# EAGLE design UKHASnet-avr-sensor (EAGLE 6.4)
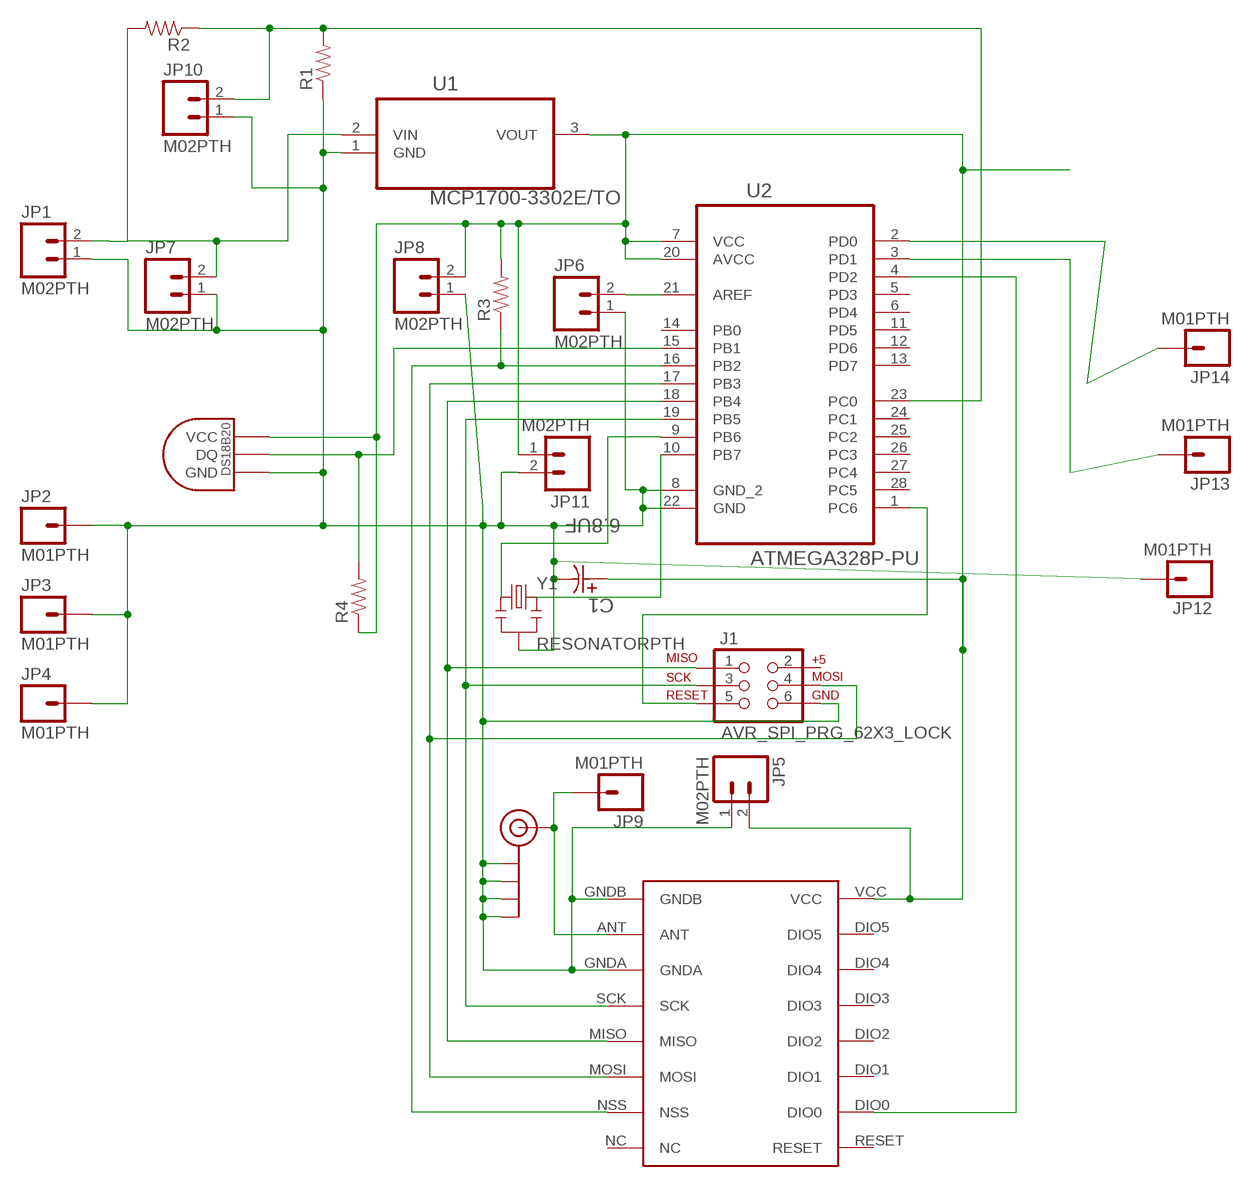
[diagram p0: schematic, sheet 1]

## Parts
C1  6.8UF  EEUFC1J6R8-P1.5  [CAPPR150-400X1200]
J1  AVR_SPI_PRG_62X3_LOCK  [2X3_LOCK]
J$1  SMA_EDGE  [SMA-EDGE]
JP1  M02PTH  [1X02]
JP2  M01PTH  [1X01]
JP3  M01PTH  [1X01]
JP4  M01PTH  [1X01]
JP5  M02PTH  [1X02]
JP6  M02PTH  [1X02]
JP7  M02PTH  [1X02]
JP8  M02PTH  [1X02]
JP9  M01PTH  [1X01]
JP10  M02PTH  [1X02]
JP11  M02PTH  [1X02]
JP12  M01PTH  [1X01]
JP13  M01PTH  [1X01]
JP14  M01PTH  [1X01]
R1  RESISTORPTH-1/4W  [AXIAL-0.4]
R2  RESISTORPTH-1/4W  [AXIAL-0.4]
R3  RESISTORPTH-1/4W  [AXIAL-0.4]
R4  RESISTORPTH-1/4W  [AXIAL-0.4]
U1  MCP1700-3302E/TO  [TO127P254X495-3]
U2  ATMEGA328P-PU  [DIP254P762X457-28]
U$1  RFM69HW  [RFM]
U$2  DS1820TO92  [DS1820]
Y1  RESONATORPTH  [RESONATOR-PTH]

## Nets
DQ: R4.P$2 U2.15(PB1) U$2.DQ
GND: C1.2 J1.6 J$1.GND@0(GND) J$1.GND@1(GND) J$1.GND@2(GND) J$1.GND@3(GND) JP1.1 JP2.1 JP3.1 JP4.1 JP5.1 JP6.1 JP7.1 JP8.1 JP10.1 JP11.2 JP12.1 R1.P$1 U1.1(GND) U2.8(GND_2) U2.22(GND) U$1.GNDA U$1.GNDB U$2.GND Y1.2
N$1: JP6.2 U2.21(AREF)
N$2: JP10.2 R1.P$2 R2.P$1 U2.23(PC0)
N$3: J1.3 U2.19(PB5) U$1.SCK
N$4: J1.5 U2.1(PC6)
N$5: J1.1 U2.18(PB4) U$1.MISO
N$6: J1.4 U2.17(PB3) U$1.MOSI
N$7: R3.P$1 U2.16(PB2) U$1.NSS
N$8: U2.4(PD2) U$1.DIO0
N$9: J$1.SIG(SIGNAL) JP9.1 U$1.ANT
N$10: U2.10(PB7) Y1.3
N$11: U2.9(PB6) Y1.1
N$12: JP14.1 U2.2(PD0)
N$13: JP13.1 U2.3(PD1)
VCC: C1.1 JP5.2 JP8.2 JP11.1 R3.P$2 R4.P$1 U1.3(VOUT) U2.7(VCC) U2.20(AVCC) U$1.VCC U$2.VDD(VCC)
VIN: JP1.2 JP7.2 R2.P$2 U1.2(VIN)
Unconnected: J1.2 U2.5(PD3) U2.6(PD4) U2.11(PD5) U2.12(PD6) U2.13(PD7) U2.14(PB0) U2.24(PC1) U2.25(PC2) U2.26(PC3) U2.27(PC4) U2.28(PC5) U$1.DIO1 U$1.DIO2 U$1.DIO3 U$1.DIO4 U$1.DIO5 U$1.NC U$1.RESET

## Library data of the parts
C1 = 1000ufCap:EEU: Aluminum Electrolytic Capacitors; MPN: EEUFC1J6R8; OC_FARNELL: 1848468; OC_NEWARK: 17T5110; RATEDVOLTAGE: 63V; SUPPLIER: PANASONIC; TOLERANCE: ±20 %
J1 = SparkFun-Connectors:AVR_SPI_PRG_6: AVR ISP 6 Pin This is the reduced ISP connector for AVR programming. Common on Arduino. This footprint will take up less PCB space and can be used with a 10-pin to 6-pin adapter such as SKU: BOB-08508
J$1 = SparkFun-Connectors:SMA_EDGE: SMA Antenna Connector End launch SMA connector. The paste layer has been removed so that the connector can be hand soldered onto the board after reflow.
JP1 JP5-JP8 JP10 JP11 = SparkFun-Connectors:M02: Standard 2-pin 0.1" header. Use with - straight break away headers ( PRT-00116) - right angle break away headers (PRT-00553) - swiss pins (PRT-00743) - machine pins (PRT-00117) - female headers (PRT-00115) Molex polarized connector foot print use with: PRT-08233 with associated crimp pins and housings. 2.54_SCREWTERM for use with PRT-10571. 3.5mm Screw Terminal footprints for PRT-08084 5mm Screw Terminal footprints for use with PRT-08433
JP2-JP4 JP9 JP12-JP14 = SparkFun-Connectors:M01: Header 1 Standard 1-pin 0.1" header. Use with straight break away headers (SKU : PRT-00116), right angle break away headers (PRT-00553), swiss pins (PRT-00743), machine pins (PRT-00117), and female headers (PRT-00115).
R1-R4 = SparkFun:RESISTOR: Resistor Basic schematic elements and footprints for 0603, 1206, and PTH resistors.
U1 = mcp1700:MCP1700-3302E/TO: IC, Low Quiescent Current LDO,3.3V,TO-92; MPN: MCP1700-3302E/TO; OC_FARNELL: 1296588; OC_NEWARK: 88H9804; PACKAGE: TO-92; SUPPLIER: Microchip
U2 = atmega328-dil:ATMEGA328P-PU: 8-bit Microcontroller with In-System Programmable Flash; MPN: ATMEGA328P-PU; OC_FARNELL: 1715487; OC_NEWARK: 15R0268; PACKAGE: PDIP-28; SUPPLIER: Atmel
U$1 = hopeRF2:RFM69HW
U$2 = Ava:DS1820: DS18B20 Programmable Resolution 1-Wire Digital Thermometer Description The DS18B20 digital thermometer provides 9-bit to 12-bit Celsius temperature measurements and has an alarm function with nonvolatile user-programmable upper and lower trigger points. The DS18B20 communicates over a 1-Wire® bus that by definition requires only one data line (and ground) for communication with a central microprocessor. It has an operating temperature range of -55°C to +125°C and is accurate to ±0.5°C over the range of -10°C to +85°C. In addition, the DS18B20 can derive power directly from the data line ("parasite power"), eliminating the need for an external power supply. Each DS18B20 has a unique 64-bit serial code, which allows multiple DS18B20s to function on the same 1-Wire bus. Thus, it is simple to use one microprocessor to control many DS18B20s distributed over a large area. Applications that can benefit from this feature include HVAC environmental controls, temperature monitoring systems inside buildings, equipment, or machinery, and process monitoring and control systems.
Y1 = SparkFun:RESONATOR: Resonator Small SMD resonator. This is the itty bitty 10/20MHz resonators with built in caps. CSTCE10M0G55 and CSTCE20M0V53. Footprint has been reviewed closely but hasn't been tested yet.

## Board
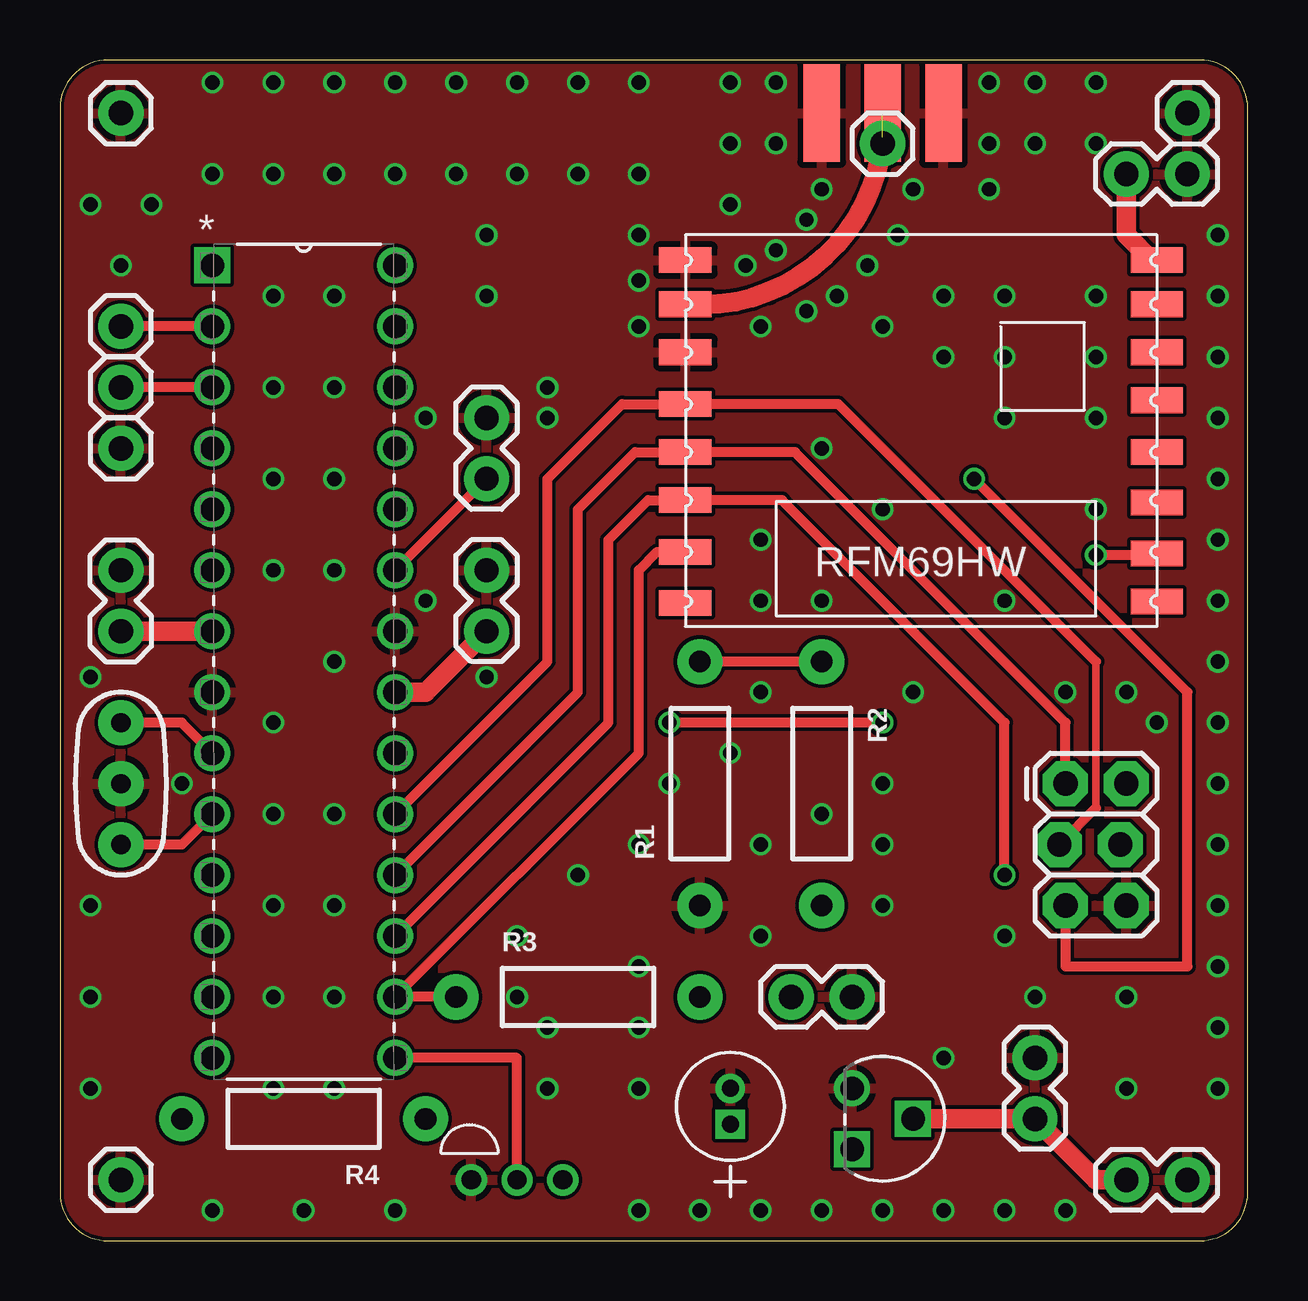
[diagram p1: board, top side]
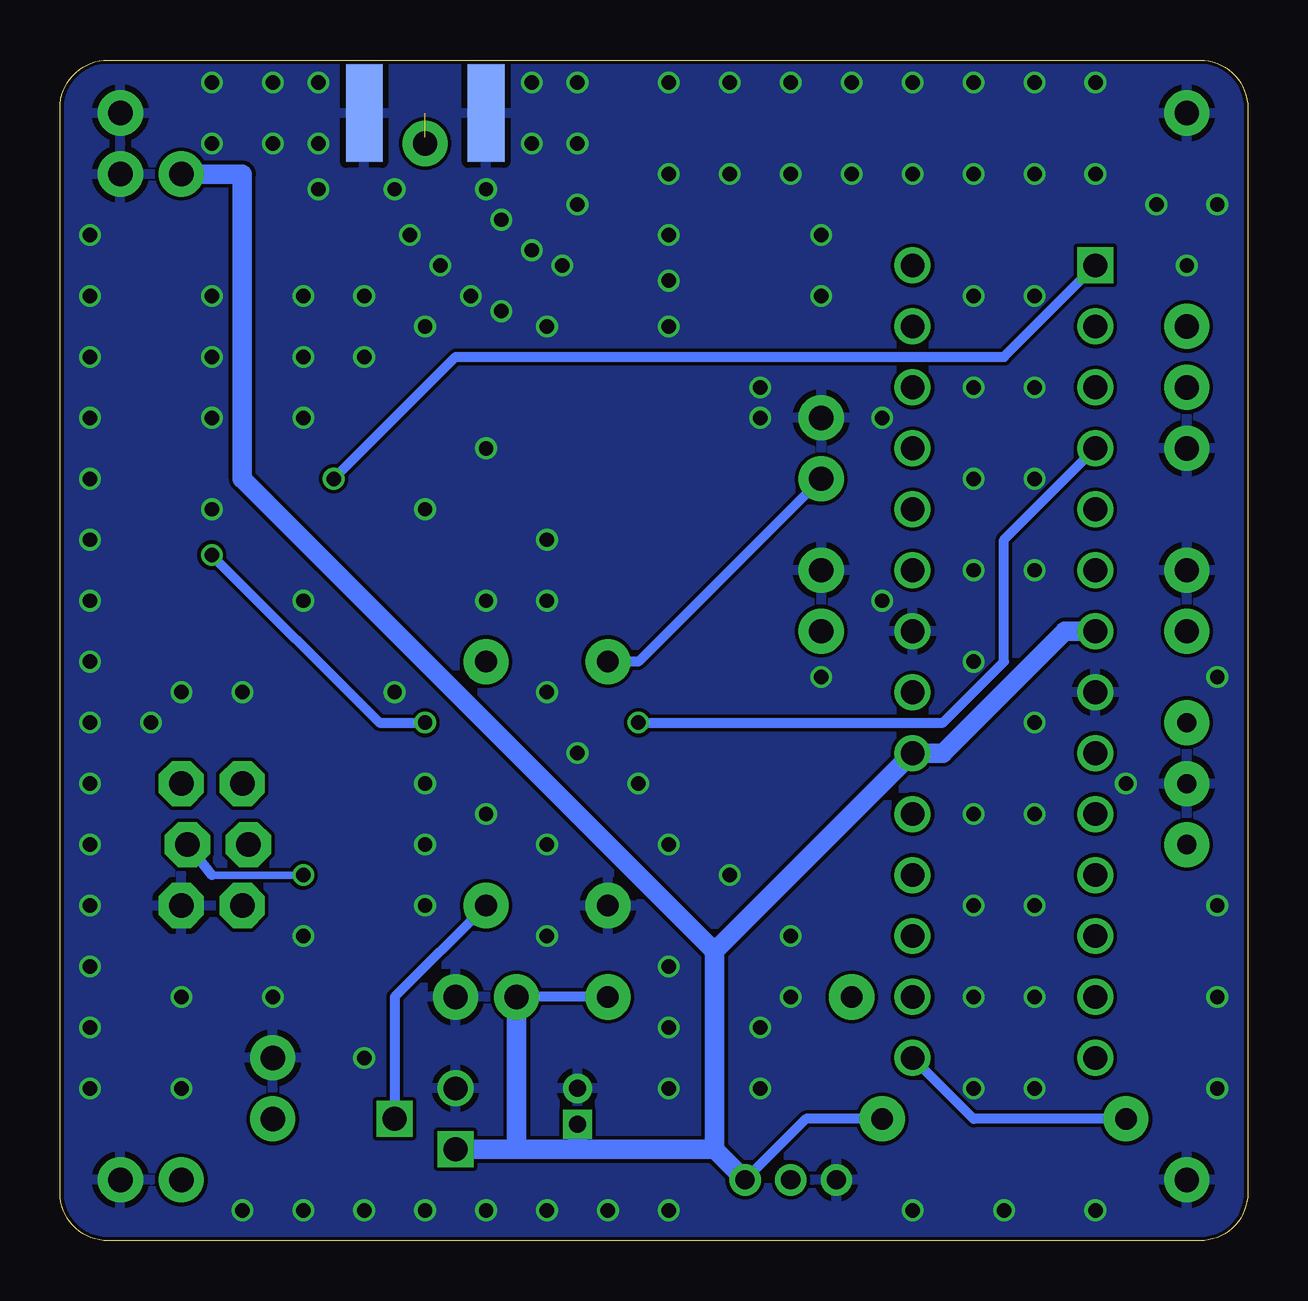
[diagram p2: board, bottom side, seen from below]

Size 49.51 x 49.2 mm. Coordinates in mm from the lower left corner, seen from the top.
Outline: 0,47.2 0,2 arc90 2,0 47.51,0 arc90 49.51,2 49.51,47.2 arc90 47.51,49.2 2,49.2 arc90 0,47.2
Copper layers (1*16): Top 0.035mm / dielectric 1.5mm / Bottom 0.035mm
Design rules "Hackvana": minimum track width 6mil, minimum drill 0.3mm, track to track 6mil, track to pad 6mil, pad to pad 6mil, via to via 6mil, smd to smd 0mil, copper to edge 6mil, drill to drill 6mil, minimum pad ring 10mil, minimum via ring 6mil, stop-mask expansion 2mil, vias tented up to drill 100mil, thermal gap 10mil

### Footprints (pad centres in the part's own frame; a part is rotated, then mirrored left to right if it is on the bottom)
CAPPR150-400X1200 = drill 0.711 square: 1 -1.499,0 | drill 0.711: 2 0,0
2X3_LOCK = drill 1.016 pad 1.88 octagon: 1 0,0; 2 0,2.54; 3 2.54,-0.254; 4 2.54,2.286; 5 5.08,0; 6 5.08,2.54
SMA-EDGE = smd 1.524 x 4.064: GND@0 0,0; GND@1 5.08,0; SIG 2.54,0 | smd 1.524 x 4.064 bottom: GND@2 0,0; GND@3 5.08,0
1X02 = drill 1.016 pad 1.88: 1 0,0; 2 2.54,0
1X01 = drill 1.016 pad 1.88: 1 0,0
AXIAL-0.4 = drill 0.9 pad 1.88: P$1 -5.08,0; P$2 5.08,0
TO127P254X495-3 = drill 0.991: 1 -2.54,-2.54 | drill 0.991 square: 2 -1.27,0; 3 0,-2.54
DIP254P762X457-28 = drill 0.991 square: 1 -7.62,33.02 | drill 0.991: 2 -7.62,30.48; 3 -7.62,27.94; 4 -7.62,25.4; 5 -7.62,22.86; 6 -7.62,20.32; 7 -7.62,17.78; 8 -7.62,15.24; 9 -7.62,12.7; 10 -7.62,10.16; 11 -7.62,7.62; 12 -7.62,5.08; 13 -7.62,2.54; 14 -7.62,0; 15 0,0; 16 0,2.54; 17 0,5.08; 18 0,7.62; 19 0,10.16; 20 0,12.7; 21 0,15.24; 22 0,17.78; 23 0,20.32; 24 0,22.86; 25 0,25.4; 26 0,27.94; 27 0,30.48; 28 0,33.02
RFM = smd 2.184 x 1.067: ANT 19.651,2.889; DIO0 0,13.27; DIO1 0,11.143; DIO2 0,9.047; DIO3 0,6.889; DIO4 0,4.889; DIO5 0,2.889; GNDA 19.651,4.889; GNDB 19.651,1.048; MISO 19.651,9.047; MOSI 19.651,11.047; NC 19.651,15.334; NSS 19.651,13.206; RESET 0,15.27; SCK 19.651,7.048; VCC 0,1.048
DS1820 = drill 0.8: DQ 2.54,-1.27; GND 0.635,-1.27; VDD 4.445,-1.27
RESONATOR-PTH = drill 0.8 pad 1.88: 1 -2.54,0; 2 0,0; 3 2.54,0

### Placement (x,y rotation side)
C1  27.94,6.35 90 top
J1  41.91,19.05 270 top
J$1  31.75,46.99 0 top
JP1  46.99,2.54 180 top
JP2  2.54,2.54 0 top
JP3  46.99,46.99 0 top
JP4  2.54,46.99 0 top
JP5  46.99,44.45 180 top
JP6  17.78,27.94 270 top
JP7  40.64,7.62 270 top
JP8  33.02,10.16 180 top
JP9  34.29,45.72 0 top
JP10  17.78,34.29 270 top
JP11  2.54,25.4 90 top
JP12  2.54,33.02 0 top
JP13  2.54,35.56 0 top
JP14  2.54,38.1 0 top
R1  26.67,19.05 90 top
R2  31.75,19.05 270 top
R3  21.59,10.16 0 top
R4  10.16,5.08 180 top
U1  35.56,3.81 270 top
U2  13.97,7.62 0 top
U$1  45.72,41.91 180 top
U$2  16.51,3.81 0 top
Y1  2.54,19.05 270 top

### Tracks (layer width: path | path; a pad name or v marks a point on that pad's centre or on a via)
DQ
  Top 0.406: U$2.DQ 19.05,7.62 U2.15
  Bottom 0.406: R4.P$2 11.43,5.08 U2.15
GND  (via drill 0.6)
  other vias: 6.35,48.26 8.89,48.26 11.43,48.26 13.97,48.26 16.51,48.26 19.05,48.26 21.59,48.26 24.13,48.26 27.94,48.26 29.84,48.26 29.84,45.72 27.94,45.72 31.75,43.81 31.11,42.55 29.84,41.27 27.94,43.18 28.57,40.64 24.13,44.45 21.59,44.45 19.05,44.45 16.51,44.45 13.97,44.45 11.43,44.45 6.35,44.45 8.89,44.45 1.27,43.18 2.54,40.64 3.81,43.18 43.18,45.72 1.27,23.5 5.08,19.05 1.27,13.97 1.27,10.16 1.27,6.35 6.35,1.27 10.16,1.27 13.97,1.27 11.43,6.35 8.89,6.35 11.43,10.16 8.89,10.16 8.89,13.97 11.43,13.97 11.43,17.78 8.89,17.78 8.89,21.59 35.56,43.81 8.89,39.37 11.43,39.37 8.89,35.56 11.43,35.56 8.89,31.75 11.43,31.75 8.89,27.94 11.43,27.94 11.43,24.13 15.24,26.67 15.24,34.29 17.78,39.37 17.78,41.91 24.13,41.91 24.13,40.01 24.13,38.1 20.32,35.56 20.32,34.29 29.21,38.1 31.11,38.73 32.38,39.37 33.66,40.64 34.92,41.91 34.29,38.1 36.83,39.37 36.83,36.83 39.37,39.37 39.37,36.83 43.18,36.83 43.18,39.37 38.73,43.81 38.73,45.72 38.73,48.26 40.64,48.26 43.18,48.26 40.64,45.72 48.26,41.91 48.26,39.37 48.26,36.83 48.26,34.29 48.26,31.75 48.26,29.21 48.26,26.67 48.26,24.13 48.26,21.59 48.26,19.05 48.26,16.51 48.26,13.97 48.26,11.43 48.26,8.89 48.26,6.35 44.45,6.35 44.45,10.16 45.72,21.59 41.91,22.86 39.37,26.67 43.18,30.48 43.18,34.29 39.37,34.29 31.75,33.02 34.29,30.48 29.21,29.21 29.21,26.67 31.75,26.67 31.75,17.78 29.21,22.86 27.94,20.32 25.4,19.05 17.78,23.5 21.59,15.24 24.13,16.51 19.05,12.7 19.05,10.16 20.32,8.89 20.32,6.35 24.13,6.35 24.13,8.89 24.13,11.43 29.21,12.7 29.21,16.51 34.29,16.51 35.56,22.86 34.29,19.05 39.37,12.7 40.64,10.16 44.45,22.86 34.29,13.97 36.83,7.62 41.91,1.27 36.83,1.27 39.37,1.27 34.29,1.27 31.75,1.27 29.21,1.27 26.67,1.27 24.13,1.27
  pour Bottom: -1.27,50.8 52.07,50.8 52.07,-2.54 -1.27,-2.54
  pour Top: -1.27,50.8 52.07,50.8 52.07,-2.54 -1.27,-2.54
N$1
  Top 0.813: U2.21 15.24,22.86 JP6.2
N$2
  Top 0.406: R2.P$1 R1.P$2 | U2.23 JP10.2
  Bottom 0.406: JP10.2 25.4,24.13 R1.P$2
N$3
  Top 0.305: 43.18,24.13 43.18,18.03
  Top 0.406: U2.19 20.32,24.13 20.32,31.75 23.43,34.86 U$1.SCK 32.45,34.86 43.18,24.13 | 43.18,18.03 J1.3
N$4  (via drill 0.6)
  Top 0.406: J1.5 41.91,11.43 46.99,11.43 46.99,22.86 v38.1,31.75
  Bottom 0.406: v38.1,31.75 33.02,36.83 10.16,36.83 U2.1
N$5
  Top 0.406: U2.18 21.59,22.86 21.59,30.48 23.97,32.86 U$1.MISO 30.64,32.86 41.91,21.59 J1.1
N$6  (via drill 0.6)
  Top 0.406: U2.17 22.86,21.59 22.86,29.21 24.51,30.86 U$1.MOSI 30.1,30.86 39.37,21.59 v39.37,15.24
  Bottom 0.305: 43.18,15.24 v39.37,15.24
  Bottom 0.406: J1.4 43.18,15.24
N$7
  Top 0.406: U$1.NSS 24.89,28.7 24.13,27.94 24.13,20.32 U2.16 R3.P$1
N$8  (via drill 0.6)
  Top 0.406: U$1.DIO0 45.66,28.57 v43.18,28.57 | v34.29,21.59 v25.4,21.59
  Bottom 0.406: v43.18,28.57 36.2,21.59 v34.29,21.59 | v25.4,21.59 12.7,21.59 10.16,24.13 10.16,29.21 U2.4
N$9  (1 unrouted)
  Top 0.813: JP9.1 34.29,45.97 arc-90 U$1.ANT
N$10
  Top 0.406: U2.10 5.08,16.51 Y1.3
N$11
  Top 0.406: U2.9 5.08,21.59 Y1.1
N$12
  Top 0.406: U2.2 JP14.1
N$13
  Top 0.406: U2.3 JP13.1
VCC
  Top 0.813: U$1.VCC 45.5,40.86 44.45,41.91 JP5.2 | U2.7 JP11.1
  Bottom 0.406: R3.P$2 JP8.2 | R4.P$1 18.41,5.08 U$2.VDD
  Bottom 0.813: U2.7 7.62,25.4 12.7,20.32 U2.20 22.23,12.06 | 22.23,12.06 22.23,3.81 | 22.23,3.81 U$2.VDD | U1.3 30.48,3.81 | 27.94,3.81 22.23,3.81 | JP8.2 30.48,3.81 | 22.23,12.06 41.91,31.75 41.91,44.45 JP5.2 | 30.48,3.81 27.94,3.81 | 27.94,3.81 C1.1
VIN
  Top 0.813: JP1.2 43.18,2.54 JP7.2 U1.2
  Bottom 0.406: R2.P$2 35.56,10.16 U1.2

### Text on the board
tDocu: http://ukhas.net/ | UKHASnet Sensor V1 | Phil M0DNY | < 6V